# Altium schematic sheet AIO-RF-v2-Sheet1.SchDoc
size A; SheetNumber: 1; SheetTotal: 1
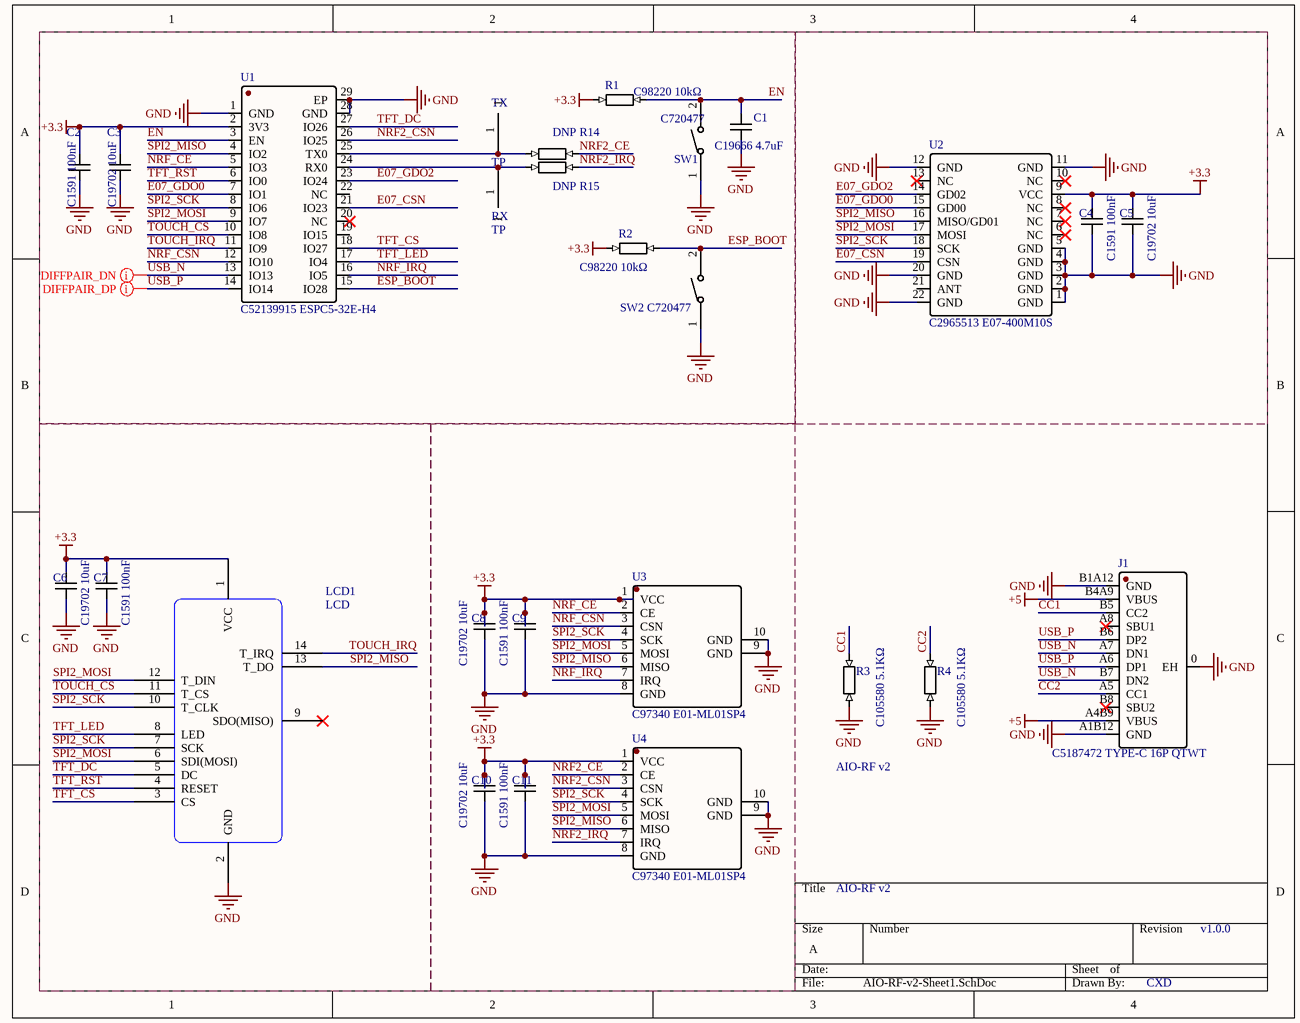
[diagram p0: AIO-RF-v2-Sheet1.SchDoc]

## Parts
C1  C19666 4.7uF  [C19666]
C2  C1591 100nF  [C1591]
C3  C19702 10uF  [C19702]
C4  C1591 100nF  [C1591]
C5  C19702 10uF  [C19702]
C6  C19702 10uF  [C19702]
C7  C1591 100nF  [C1591]
C8  C19702 10uF  [C19702]
C9  C1591 100nF  [C1591]
C10  C19702 10uF  [C19702]
C11  C1591 100nF  [C1591]
J1  C5187472 TYPE-C 16P QTWT  [C5187472]
LCD1  LCD  [LCD]
R1  C98220 10kΩ  [C98220]
R2  C98220 10kΩ  [C98220]
R3  C105580 5.1KΩ  [C105580]
R4  C105580 5.1KΩ  [C105580]
R14  DNP  [C98220]
R15  DNP  [C98220]
RX  TP  [TP]
SW1  C720477  [C720477]
SW2  C720477  [C720477]
TX  TP  [TP]
U1  C52139915 ESPC5-32E-H4  [C52139915]
U2  C2965513 E07-400M10S  [C2965513]
U3  C97340 E01-ML01SP4  [C97340]
U4  C97340 E01-ML01SP4  [C97340]

## Nets
+3.3: C2.2 C3.2 C4.2 C5.2 C6.2 C7.2 C8.1 C9.1 C10.1 C11.1 LCD1.1(VCC) R1.1 R2.1 U1.2(3V3) U2.9(VCC) U3.1(VCC) U4.1(VCC)
+5: J1.A4B9(VBUS) J1.B4A9(VBUS)
GND: C1.2 C2.1 C3.1 C4.1 C5.1 C6.1 C7.1 C8.2 C9.2 C10.2 C11.2 J1.0(EH) J1.A1B12(GND) J1.B1A12(GND) LCD1.2(GND) R3.1 R4.1 SW1.1 SW2.1 U1.1(GND) U1.28(GND) U1.29(EP) U2.1(GND) U2.2(GND) U2.3(GND) U2.4(GND) U2.5(GND) U2.11(GND) U2.12(GND) U2.20(GND) U2.22(GND) U3.8(GND) U3.9(GND) U3.10(GND) U4.8(GND) U4.9(GND) U4.10(GND)
CC1: J1.B5(CC2) R3.2
CC2: J1.A5(CC1) R4.2
E07_CSN: U1.21(IO23) U2.19(CSN)
E07_GDO0: U1.7(IO1) U2.15(GD00)
E07_GDO2: U1.23(IO24) U2.14(GD02)
EN: C1.1 R1.2 SW1.2 U1.3(EN)
ESP_BOOT: R2.2 SW2.2 U1.15(IO28)
NRF2_CE: R15.2 U4.2(CE)
NRF2_CSN: U1.26(IO25) U4.3(CSN)
NRF2_IRQ: R14.2 U4.7(IRQ)
NRF_CE: U1.5(IO3) U3.2(CE)
NRF_CSN: U1.12(IO10) U3.3(CSN)
NRF_IRQ: U1.16(IO5) U3.7(IRQ)
SPI2_MISO: LCD1.13(T_DO) U1.4(IO2) U2.16(MISO/GD01) U3.6(MISO) U4.6(MISO)
SPI2_MOSI: LCD1.6(SDI(MOSI)) LCD1.12(T_DIN) U1.9(IO7) U2.17(MOSI) U3.5(MOSI) U4.5(MOSI)
SPI2_SCK: LCD1.7(SCK) LCD1.10(T_CLK) U1.8(IO6) U2.18(SCK) U3.4(SCK) U4.4(SCK)
TFT_CS: LCD1.3(CS) U1.18(IO27)
TFT_DC: LCD1.5(DC) U1.27(IO26)
TFT_LED: LCD1.8(LED) U1.17(IO4)
TFT_RST: LCD1.4(RESET) U1.6(IO0)
TOUCH_CS: LCD1.11(T_CS) U1.10(IO8)
TOUCH_IRQ: LCD1.14(T_IRQ) U1.11(IO9)
USB_N: J1.A7(DN1) J1.B7(DN2) U1.13(IO13)
USB_P: J1.A6(DP1) J1.B6(DP2) U1.14(IO14)
NetR14_1: R14.1 RX.1 U1.24(RX0)
NetR15_1: R15.1 TX.1 U1.25(TX0)

Not connected (* = marked no-connect by the designer): J1 A8(SBU1)* B8(SBU2)*; LCD1 9(SDO(MISO))*; U1 19(IO15) 20(NC)* 22(NC); U2 6(NC)* 7(NC)* 8(NC)* 10(NC)* 13(NC)* 21(ANT)

## Layout directives
differential pair: USB_N, USB_P

## Notes on the sheet
- AIO-RF v2
- v1.0.0
- CXD

## Library data of the parts
C1 = C19666: 4.7uF (475) ±10% 16V; Manufacturer: SAMSUNG(三星); Manufacturer Part Number: CL10A475KO8NNNC; LCSC Part Number: C19666; Supplier: LCSC; Supplier Part Number: C19666; Imported By: JLCAltiumImporter 0.3.1; Package: C0603
C2 C4 C7 C9 C11 = C1591: 100nF (104) ±10% 50V; Manufacturer: SAMSUNG(三星); Manufacturer Part Number: CL10B104KB8NNNC; LCSC Part Number: C1591; Supplier: LCSC; Supplier Part Number: C1591; Imported By: JLCAltiumImporter 0.3.1; Package: C0603
C3 C5 C6 C8 C10 = C19702: Manufacturer: SAMSUNG(三星); Manufacturer Part Number: CL10A106KP8NNNC; LCSC Part Number: C19702; Supplier: LCSC; Supplier Part Number: C19702; Imported By: JLCAltiumImporter 0.3.1; Package: C0603
J1 = C5187472: Manufacturer: SHOU HAN(首韩); LCSC Part Number: C5187472; Supplier: LCSC; Supplier Part Number: C5187472; Imported By: JLCAltiumImporter 0.2.3; Manufacturer Part Number: TYPE-C 16P QTWT; Package: USB-TYPE-C-SMD_TYPE-C-16P-QTWT
R1 R2 R14 R15 = C98220: Manufacturer: YAGEO(国巨); Manufacturer Part Number: RC0603FR-0710KL; LCSC Part Number: C98220; Supplier: LCSC; Supplier Part Number: C98220; Imported By: JLCAltiumImporter 0.3.1; Package: R0603
R3 R4 = C105580: Manufacturer: YAGEO(国巨); Manufacturer Part Number: RC0603FR-075K1L; Supplier: LCSC; Supplier Part Number: C105580; Imported By: JLCAltiumImporter 0.3.1; Package: R0603; LCSC Part Number: C105580
SW1 SW2 = C720477: Manufacturer: XUNPU(讯普); Manufacturer Part Number: TS-1088-AR02016; LCSC Part Number: C720477; Supplier: LCSC; Supplier Part Number: C720477; Imported By: JLCAltiumImporter 0.2.3; Package: SW-SMD_L3.9-W3.0-P4.45
U1 = C52139915: Manufacturer: DOIT(四博智联); LCSC Part Number: C52139915; Supplier: LCSC; Supplier Part Number: C52139915; Imported By: JLCAltiumImporter 0.2.3; Manufacturer Part Number: ESPC5-32E-H4; Package: WIFIM-SMD_28P-L19.2-W18.0-P1.27-TL_ESPC5-32E-H4
U2 = C2965513: Manufacturer: EBYTE(亿佰特); LCSC Part Number: C2965513; Supplier: LCSC; Supplier Part Number: C2965513; Imported By: JLCAltiumImporter 0.2.3; Manufacturer Part Number: E07-400M10S; Package: COMM-SMD_E07-400M10S
U3 U4 = C97340: Manufacturer: EBYTE(亿佰特); LCSC Part Number: C97340; Supplier: LCSC; Supplier Part Number: C97340; Imported By: JLCAltiumImporter 0.2.3; Manufacturer Part Number: E01-ML01SP4; Package: WIRELM-TH_E01-ML01SP4